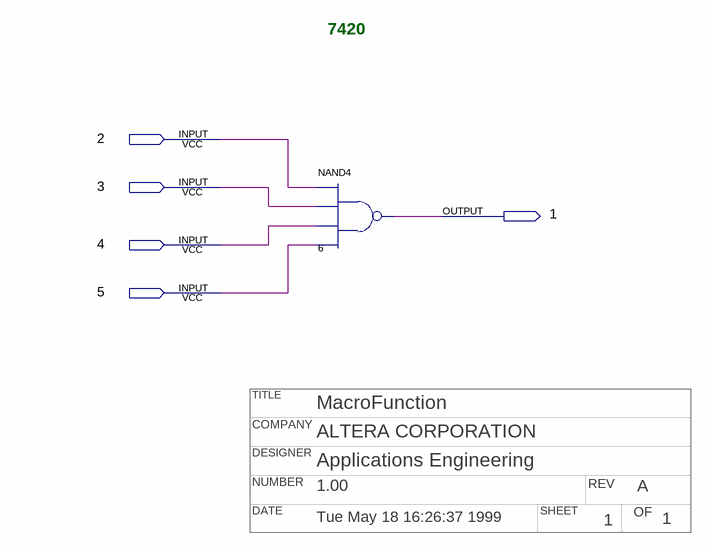
[diagram p0: schematic sheet]
// Quartus schematic 7420.bdf as structural Verilog: 1 symbols, 5 pins
// Title block: TITLE: MacroFunction; COMPANY: ALTERA CORPORATION; DESIGNER: Applications Engineering; NUMBER: 1.00; REV: A; DATE: Tue May 18 16:26:37 1999; SHEET: 1; OF: 1
module \7420  (
  input  \2 ,
  input  \3 ,
  input  \4 ,
  input  \5 ,
  output \1 
);

  nand u_6 (\1 , \2 , \3 , \4 , \5 );

  // Notes on the sheet:
  //   7420
endmodule
